# EAGLE schematic BeltBoard (EAGLE 9.5.2)
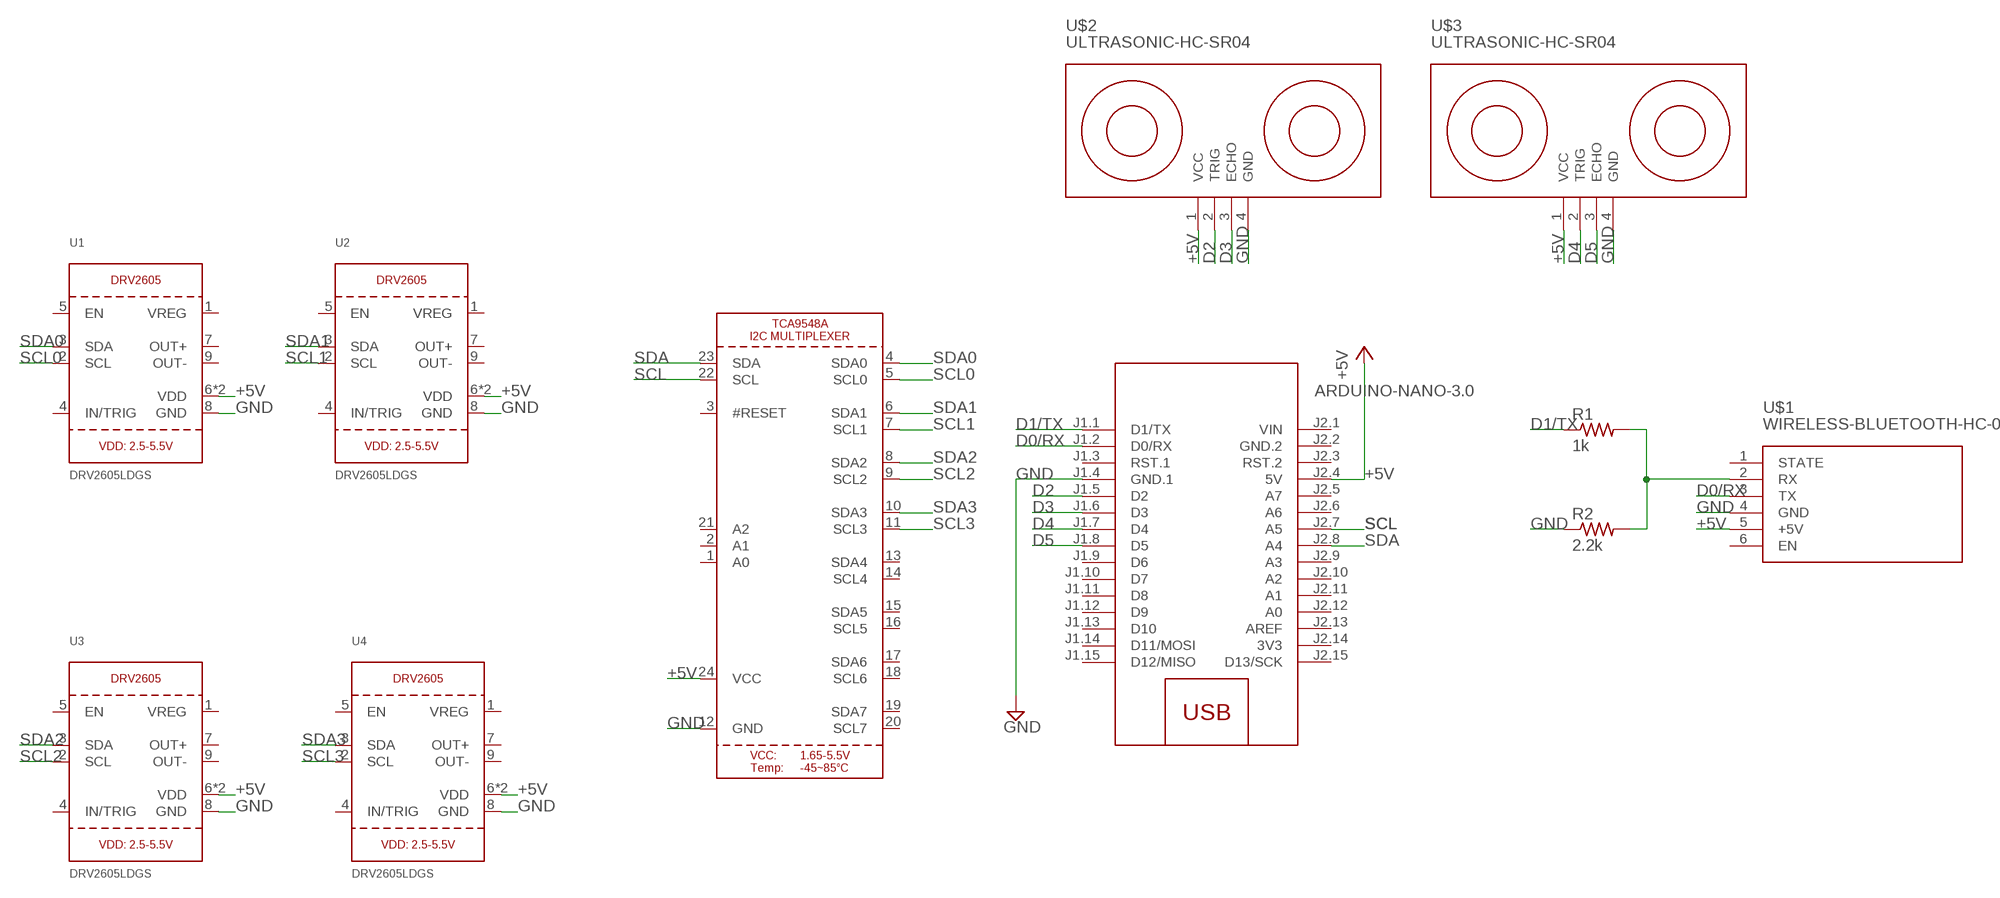
[diagram p0: schematic, sheet 1]

## Parts
M1  ARDUINO-NANO-3.0  [ARDUINO-NANO-3.0]
R1  1k  R-US_R0805  [R0805]
R2  2.2k  R-US_R0805  [R0805]
U1  DRV2605LDGS  DRV2605_SOP  [PSOP10]
U2  DRV2605LDGS  DRV2605_SOP  [PSOP10]
U3  DRV2605LDGS  DRV2605_SOP  [PSOP10]
U4  DRV2605LDGS  DRV2605_SOP  [PSOP10]
U5  TCA9548APWR  TCA9548A  [TSSOP24]
U$1  WIRELESS-BLUETOOTH-HC-05  [WIRELESS-BLUETOOTH-HC-05]
U$2  ULTRASONIC-HC-SR04  [ULTRASONIC-HC-SR04]
U$3  ULTRASONIC-HC-SR04  [ULTRASONIC-HC-SR04]

## Nets
+5V: M1.J2.4(5V) U1.6(VDD) U1.10(VDD) U2.6(VDD) U2.10(VDD) U3.6(VDD) U3.10(VDD) U4.6(VDD) U4.10(VDD) U5.24(VCC) U$1.5(+5V) U$2.1(VCC) U$3.1(VCC)
D0/RX: M1.J1.2(D0/RX) U$1.3(TX)
D1/TX: M1.J1.1(D1/TX) R1.1
D2: M1.J1.5(D2) U$2.2(TRIG)
D3: M1.J1.6(D3) U$2.3(ECHO)
D4: M1.J1.7(D4) U$3.2(TRIG)
D5: M1.J1.8(D5) U$3.3(ECHO)
GND: M1.J1.4(GND.1) R2.1 U1.8(GND) U2.8(GND) U3.8(GND) U4.8(GND) U5.12(GND) U$1.4(GND) U$2.4(GND) U$3.4(GND)
N$37: R1.2 R2.2 U$1.2(RX)
SCL: M1.J2.7(A5) U5.22(SCL)
SCL0: U1.2(SCL) U5.5(SCL0)
SCL1: U2.2(SCL) U5.7(SCL1)
SCL2: U3.2(SCL) U5.9(SCL2)
SCL3: U4.2(SCL) U5.11(SCL3)
SDA: M1.J2.8(A4) U5.23(SDA)
SDA0: U1.3(SDA) U5.4(SDA0)
SDA1: U2.3(SDA) U5.6(SDA1)
SDA2: U3.3(SDA) U5.8(SDA2)
SDA3: U4.3(SDA) U5.10(SDA3)
Unconnected: M1.J1.3(RST.1) M1.J1.9(D6) M1.J1.10(D7) M1.J1.11(D8) M1.J1.12(D9) M1.J1.13(D10) M1.J1.14(D11/MOSI) M1.J1.15(D12/MISO) M1.J2.3(RST.2) M1.J2.5(A7) M1.J2.6(A6) M1.J2.9(A3) M1.J2.10(A2) M1.J2.11(A1) M1.J2.12(A0) M1.J2.13(AREF) M1.J2.15(D13/SCK) U1.1(VREG) U1.4(IN/TRIG) U1.5(EN) U1.7(OUT+) U1.9(OUT-) U2.1(VREG) U2.4(IN/TRIG) U2.5(EN) U2.7(OUT+) U2.9(OUT-) U3.1(VREG) U3.4(IN/TRIG) U3.5(EN) U3.7(OUT+) U3.9(OUT-) U4.1(VREG) U4.4(IN/TRIG) U4.5(EN) U4.7(OUT+) U4.9(OUT-) U5.1(A0) U5.2(A1) U5.3(#RESET) U5.13(SDA4) U5.14(SCL4) U5.15(SDA5) U5.16(SCL5) U5.17(SDA6) U5.18(SCL6) U5.19(SDA7) U5.20(SCL7) U5.21(A2) U$1.1(STATE) U$1.6(EN)

## Power pins joined to a net without a drawn wire
3V3: M1.J2.14(3V3)
GND.2: M1.J2.2(GND.2)
VIN: M1.J2.1(VIN)

## Library data of the parts
M1 = diy-modules:ARDUINO-NANO-3.0: Arduino Nano 3.0 and compatible devices More details available here: https://www.arduino.cc/en/Main/ArduinoBoardNano Click here to find device on ebay.com <http://www.ebay.com/sch/arduino+nano>
R1 R2 = rcl:R-US_: RESISTOR, American symbol; SPICEPREFIX: R
U1-U4 = microbuilder:DRV2605: DRV2605 - Haptic Driver for ERM/LRA Motors
U5 = microbuilder:TCA9548A: TCA9548A I2C Multiplexer
U$1 = diy-modules:WIRELESS-BLUETOOTH-HC-05: Bluetooth Transceiver Module based on HC-05 board Tutorial is available here: https://arduino-info.wikispaces.com/BlueTooth-HC05-HC06-Modules-How-To Click here to find device on ebay.com <http://www.ebay.com/sch/hc-05+module+rs232>
U$2 U$3 = diy-modules:ULTRASONIC-HC-SR04: Ultrasonic Ranging Module HC-SR04 More details available here: http://randomnerdtutorials.com/complete-guide-for-ultrasonic-sensor-hc-sr04/ Click here to find device on ebay.com <http://www.ebay.com/sch/hc+sr04+ultrasonic>